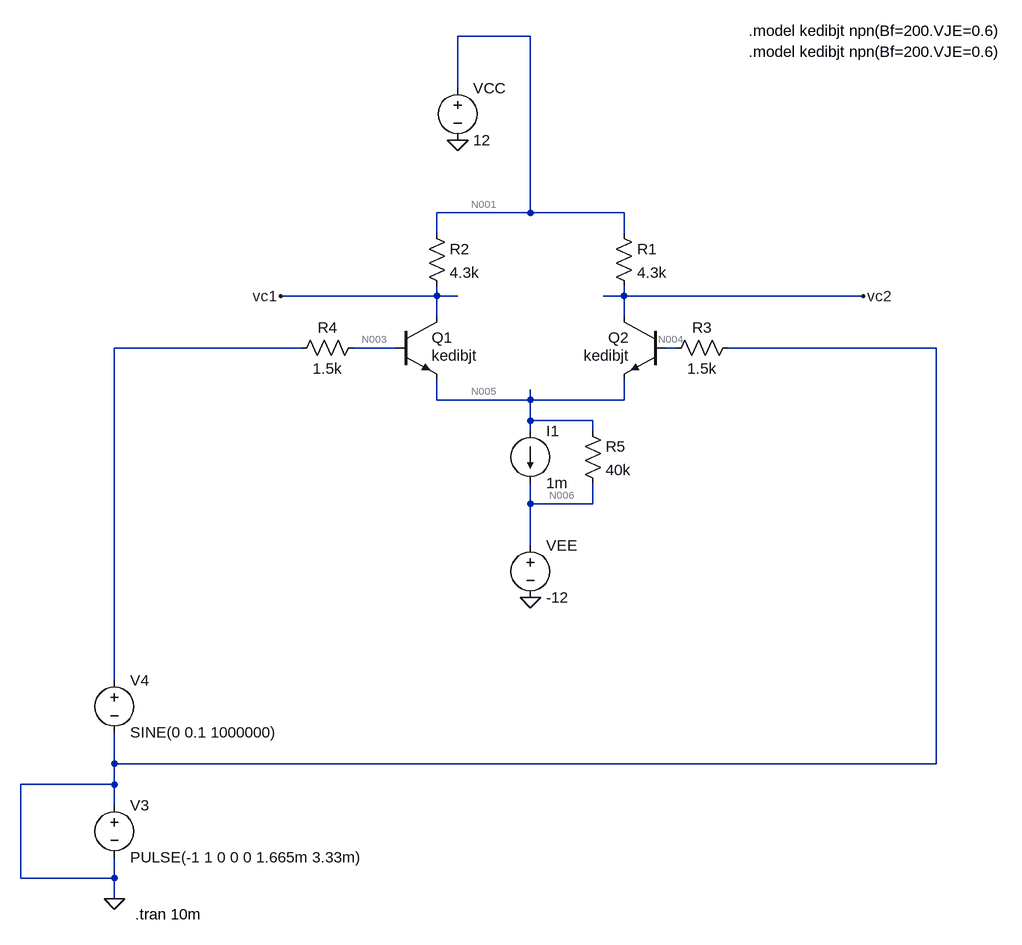
[diagram p0: schematic 7.2.asc]
7.2.asc, the LTspice schematic file:
Version 4
SHEET 1 1288 1096
WIRE 128 -272 16 -272
WIRE 16 -192 16 -272
WIRE 128 0 128 -272
WIRE 128 0 -16 0
WIRE 272 0 128 0
WIRE -16 32 -16 0
WIRE 272 32 272 0
WIRE -16 128 -16 112
WIRE -16 128 -256 128
WIRE 16 128 -16 128
WIRE 272 128 272 112
WIRE 272 128 240 128
WIRE 640 128 272 128
WIRE -16 160 -16 128
WIRE 272 160 272 128
WIRE -224 208 -512 208
WIRE -80 208 -144 208
WIRE 352 208 336 208
WIRE 752 208 432 208
WIRE -16 288 -16 256
WIRE 128 288 128 272
WIRE 128 288 -16 288
WIRE 272 288 272 256
WIRE 272 288 128 288
WIRE 128 320 128 288
WIRE 224 320 128 320
WIRE 128 336 128 320
WIRE 224 336 224 320
WIRE 128 448 128 416
WIRE 224 448 224 416
WIRE 224 448 128 448
WIRE 128 512 128 448
WIRE -512 720 -512 208
WIRE -512 848 -512 800
WIRE 752 848 752 208
WIRE 752 848 -512 848
WIRE -512 880 -512 848
WIRE -512 880 -656 880
WIRE -512 912 -512 880
WIRE -656 1024 -656 880
WIRE -512 1024 -512 992
WIRE -512 1024 -656 1024
WIRE -512 1056 -512 1024
FLAG 16 -112 0
FLAG 128 592 0
FLAG 640 128 vc2
FLAG -256 128 vc1
FLAG -512 1056 0
SYMBOL npn -80 160 R0
WINDOW 3 56 60 Left 2
SYMATTR Value kedibjt
SYMATTR InstName Q1
SYMBOL voltage 16 -208 R0
WINDOW 123 0 0 Left 0
WINDOW 39 0 0 Left 0
SYMATTR InstName VCC
SYMATTR Value 12
SYMBOL npn 336 160 M0
WINDOW 3 56 60 Left 2
SYMATTR Value kedibjt
SYMATTR InstName Q2
SYMBOL res 256 16 R0
SYMATTR InstName R1
SYMATTR Value 4.3k
SYMBOL res -32 16 R0
SYMATTR InstName R2
SYMATTR Value 4.3k
SYMBOL voltage 128 496 R0
SYMATTR InstName VEE
SYMATTR Value -12
SYMBOL res 448 192 R90
WINDOW 0 0 56 VBottom 2
WINDOW 3 32 56 VTop 2
SYMATTR InstName R3
SYMATTR Value 1.5k
SYMBOL res -128 192 R90
WINDOW 0 0 56 VBottom 2
WINDOW 3 32 56 VTop 2
SYMATTR InstName R4
SYMATTR Value 1.5k
SYMBOL voltage -512 896 R0
WINDOW 123 0 0 Left 0
WINDOW 39 0 0 Left 0
SYMATTR InstName V3
SYMATTR Value PULSE(-1 1 0 0 0 1.665m 3.33m)
SYMBOL voltage -512 704 R0
WINDOW 123 0 0 Left 0
WINDOW 39 0 0 Left 0
SYMATTR InstName V4
SYMATTR Value SINE(0 0.1 1000000)
SYMBOL current 128 336 R0
WINDOW 123 0 0 Left 0
WINDOW 39 0 0 Left 0
SYMATTR InstName I1
SYMATTR Value 1m
SYMBOL res 208 320 R0
SYMATTR InstName R5
SYMATTR Value 40k
TEXT 464 -280 Left 2 !.model kedibjt npn(Bf=200.VJE=0.6)
TEXT -480 1080 Left 2 !.tran 10m
TEXT 464 -248 Left 2 !.model kedibjt npn(Bf=200.VJE=0.6)

The netlist it stands for:
* 7.2.asc
Q1 vc1 N003 N005 0 kedibjt
VCC N001 0 12
Q2 vc2 N004 N005 0 kedibjt
R1 N001 vc2 4.3k
R2 N001 vc1 4.3k
VEE N006 0 -12
R3 0 N004 1.5k
R4 N003 N002 1.5k
V3 0 0 PULSE(-1 1 0 0 0 1.665m 3.33m)
V4 N002 0 SINE(0 0.1 1000000)
I1 N005 N006 1m
R5 N005 N006 40k
.model NPN NPN
.model PNP PNP
.lib standard.bjt
.model kedibjt npn(Bf=200.VJE=0.6)
.tran 10m
.model kedibjt npn(Bf=200.VJE=0.6)
.backanno
.end

* Results of the author's LTspice run, read from the files saved beside the schematic
* Operating Point, zero values left out:
*   V(vc1) = 9.26 V
*   V(n003) = -4.779 mV
*   V(n005) = -767.4 mV
*   V(n001) = 12 V
*   V(vc2) = 9.26 V
*   V(n004) = -4.779 mV
*   V(n006) = -12 V
*   Ic(Q2) = 637.2 µA
*   Ib(Q2) = 3.186 µA
*   Ie(Q2) = -640.4 µA
*   Ic(Q1) = 637.2 µA
*   Ib(Q1) = 3.186 µA
*   Ie(Q1) = -640.4 µA
*   I(I1) = 1 mA
*   I(R5) = 280.8 µA
*   I(R4) = -3.186 µA
*   I(R3) = 3.186 µA
*   I(R2) = 637.2 µA
*   I(R1) = 637.2 µA
*   I(V4) = -3.186 µA
*   I(Vee) = 1.281 mA
*   I(Vcc) = -1.274 mA